# Altium schematic sheet EPS_Battery_Controller.SchDoc: Battery / Controller
size A4; SheetNumber: 26; SheetTotal: 51
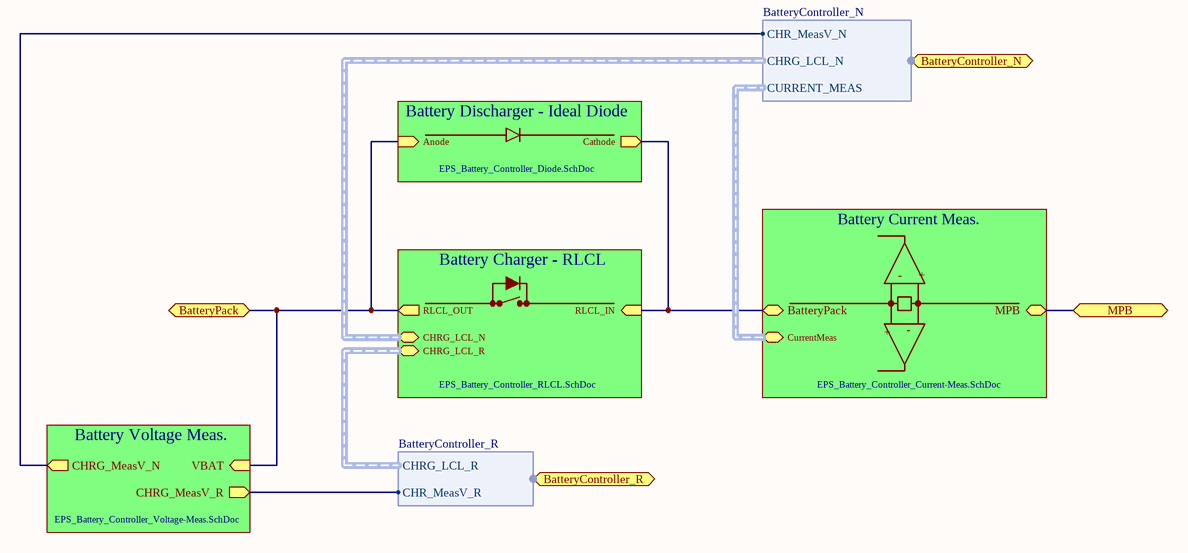
[diagram p0: EPS_Battery_Controller.SchDoc]

## Sub-sheets
Battery Charger - RLCL = EPS_Battery_Controller_RLCL.SchDoc: RLCL_IN (in), RLCL_OUT (out), CHRG_LCL_N (harness CHRG_LCL_N), CHRG_LCL_R (harness CHRG_LCL_R)
Battery Current Meas. = EPS_Battery_Controller_Current-Meas.SchDoc: CurrentMeas (harness CURRENT_MEAS), BatteryPack, MPB (bidir)
Battery Discharger - Ideal Diode = EPS_Battery_Controller_Diode.SchDoc: Cathode (out), Anode (in)
Battery Voltage Meas. = EPS_Battery_Controller_Voltage-Meas.SchDoc: VBAT (in), CHRG_MeasV_R (out), CHRG_MeasV_N (out)

## Ports
BatteryController_N (harness BatteryController_N), BatteryController_R (harness BatteryController_R), BatteryPack, MPB (bidir)

## Harnesses
BatteryController_R: CHRG_LCL_R, CHR_MeasV_R
BatteryController_N: CHRG_LCL_N, CURRENT_MEAS, CHR_MeasV_N

## Nets
BatteryPack: port BatteryPack, sheet Battery Voltage Meas./VBAT, sheet Battery Discharger - Ideal Diode/Anode, sheet Battery Charger - RLCL/RLCL_OUT
MPB: port MPB, sheet Battery Current Meas./MPB
(unnamed): sheet Battery Current Meas./BatteryPack, sheet Battery Discharger - Ideal Diode/Cathode, sheet Battery Charger - RLCL/RLCL_IN
(unnamed): sheet Battery Voltage Meas./CHRG_MeasV_R, port BatteryController_R.CHR_MeasV_R
(unnamed): sheet Battery Voltage Meas./CHRG_MeasV_N, port BatteryController_N.CHR_MeasV_N

## Notes on the sheet
- -
- +
- Title:
- Project:
- Author:
- Model:
- Document Number:
- Checked by:
- Rev:
- Date:
- Approved by:
- Sheet:
- of
- File name: